# Altium schematic sheet LM334.SchDoc
size A
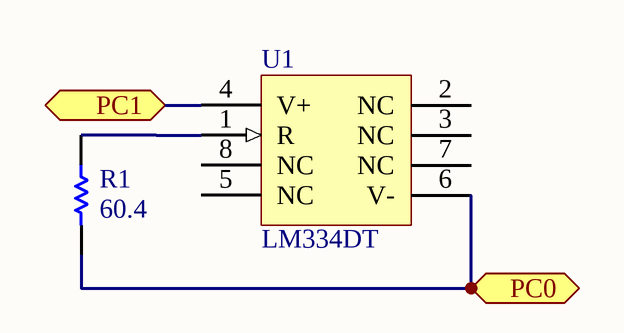
[diagram p0: LM334.SchDoc]

## Parts
R1  value 60.4  [SMD-0805-RES]  (hidden comment: Res1)
U1  LM334DT  [M08A_M]

## Ports
PC0, PC1

## Nets
PC0: R1.2 U1.6(V-) ; port PC0
PC1: U1.4(V+) ; port PC1
NetR1_1: R1.1 U1.1(R)

Not connected (* = marked no-connect by the designer): U1 2(NC) 3(NC) 5(NC) 7(NC) 8(NC)

## Library data of the parts
R1 = Res1: Resistor; Published: 8-Jun-2000; LatestRevisionDate: 17-Jul-2002; LatestRevisionNote: Re-released for DXP Platform.; PackageReference: AXIAL-0.3; Publisher: Altium Limited; PackageDescription: Axial Device, Thru-Hole; 2 Leads; 0.3 in Pin Spacing
U1 = LM334DT: 3-Terminal Adjustable Current Source, 8-pin Narrow SOIC; PartNumber: LM334M; Manufacturer: National Semiconductor; PackageTopMarking: NSZXTT*LM334*M; PowerWise: N; CompType: MiscPower; High-Reliability: Y; DatasheetVersion: Mar-2005; PackageVersion: revM, May-2009; PackageReference: M08A; PackageDescription: SOIC Narrow, 4.9 x 3.9 x 1.45mm, 8 Lead, 1.27mm Pitch; RoHS: N; PinCount: 8; Code_JEDEC: MS-012-AA; Code_IPC: SOIC127P600-8; ComponentLink1Description: Manufacturer URL; ComponentLink1URL: http://www.national.com/; ComponentLink2Description: LM334 Datasheet; ComponentLink2URL: http://www.national.com/ds/LM/LM334.pdf; ComponentLink3Description: LM334 Web Page; ComponentLink3URL: http://www.national.com/pf/LM/LM334.html; ComponentLink4Description: M08A Package Page; ComponentLink4URL: http://www.national.com/packaging/folders/m08a.html